# EAGLE design escon-50-5-mobo (EAGLE 7.7.0)
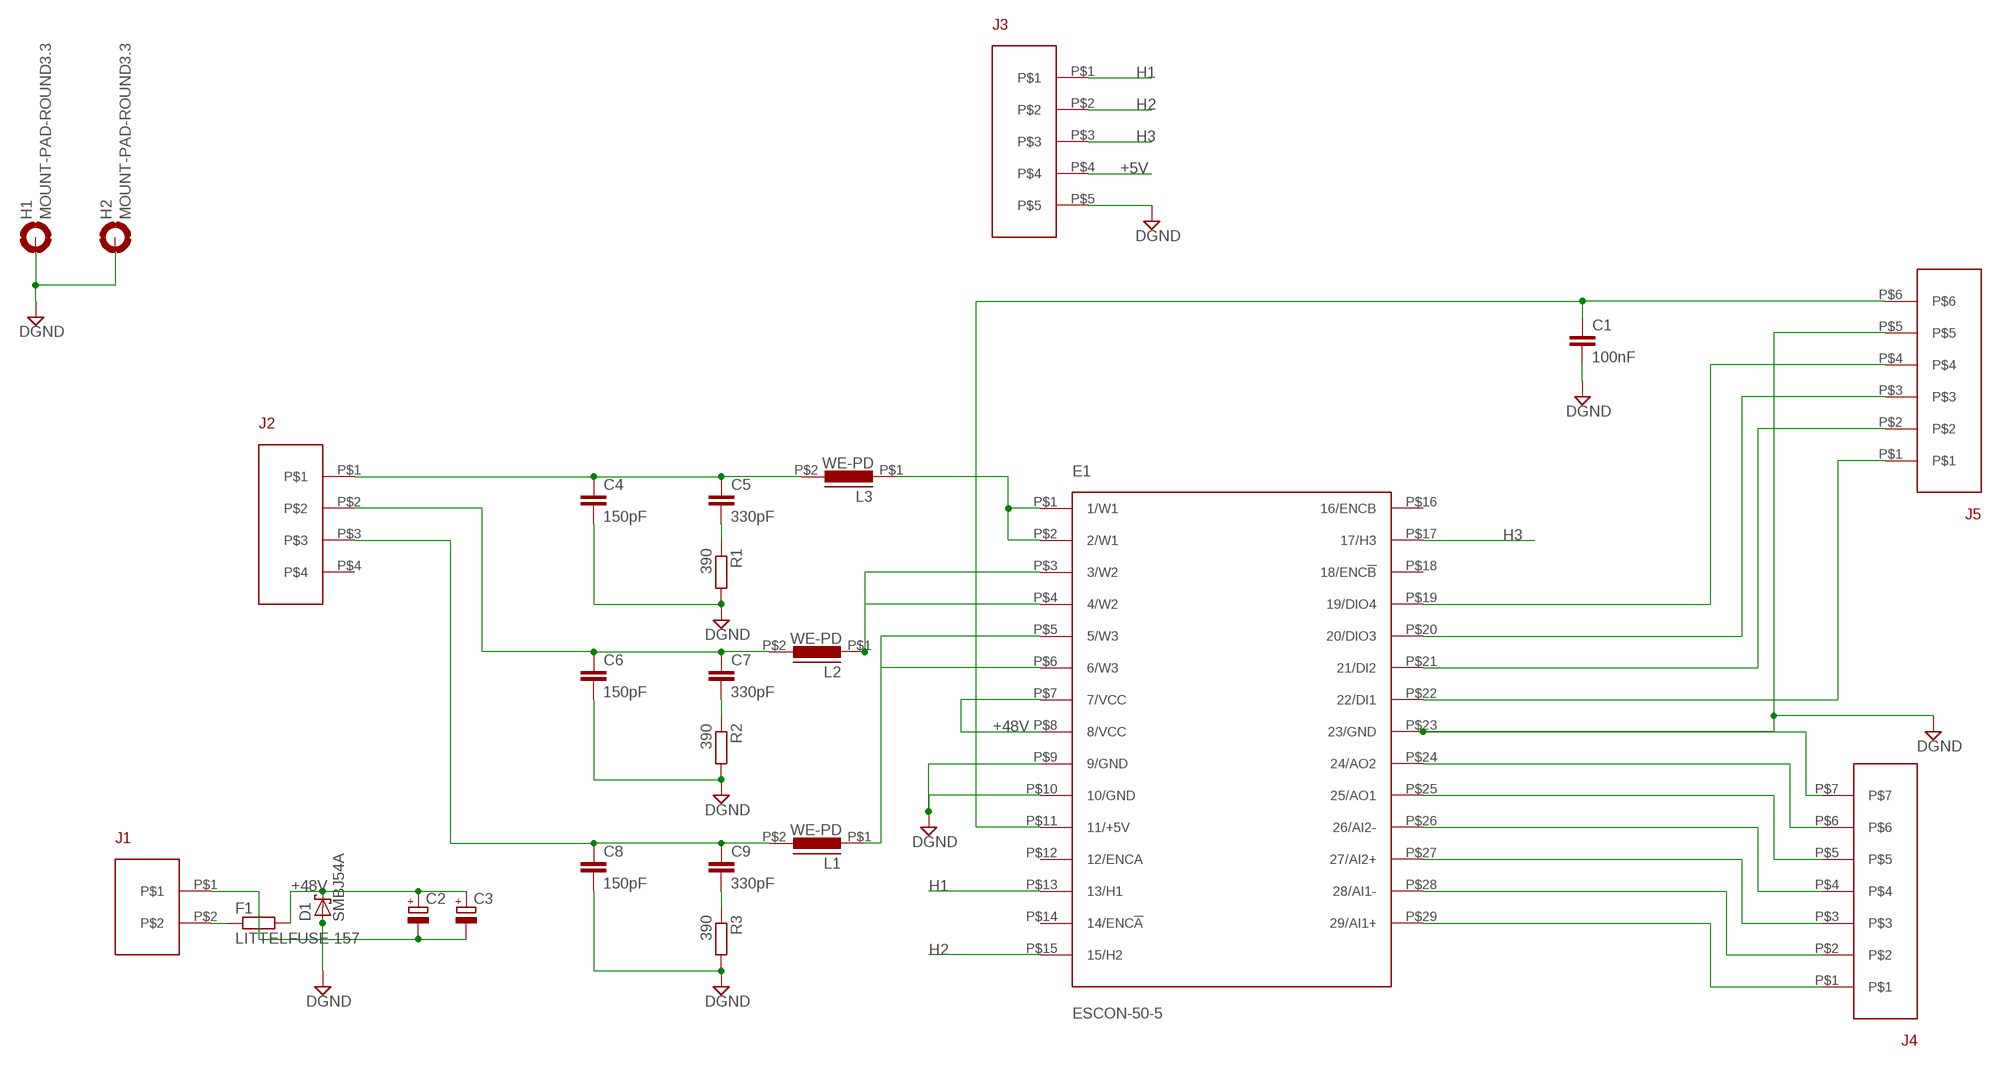
[diagram p0: schematic, sheet 1]

## Parts
C1  100nF  C-EUC0805  [C0805]
C2  CPOL-EUE5-13  [E5-13]
C3  CPOL-EUE5-13  [E5-13]
C4  150pF  C-EUC0805  [C0805]
C5  330pF  C-EUC0805  [C0805]
C6  150pF  C-EUC0805  [C0805]
C7  330pF  C-EUC0805  [C0805]
C8  150pF  C-EUC0805  [C0805]
C9  330pF  C-EUC0805  [C0805]
D1  SMBJ54A  [SMBJ54A]
E1  ESCON-50-5  [ESCON-50-5]
F1  LITTELFUSE-157  [LITTELFUSE-157]
H1  MOUNT-PAD-ROUND3.3  [3,3-PAD]
H2  MOUNT-PAD-ROUND3.3  [3,3-PAD]
J1  PHOENIX-COMBICON-MCV-2POS  [PHOENIX-COMBICON-MCV-2POS]
J2  PHOENIX-COMBICON-MCV-4POS  [PHOENIX-COMBICON-MCV-4POS]
J3  PHOENIX-COMBICON-MCV-5POS  [PHOENIX-COMBICON-MCV-5POS]
J4  PHOENIX-COMBICON-MCV-7POS  [PHOENIX-COMBICON-MCV-7POS]
J5  PHOENIX-COMBICON-MCV-6POS  [PHOENIX-COMBICON-MCV-6POS]
L1  WE-PD  [WE-PD]
L2  WE-PD  [WE-PD]
L3  WE-PD  [WE-PD]
R1  390  R-EU_R0805  [R0805]
R2  390  R-EU_R0805  [R0805]
R3  390  R-EU_R0805  [R0805]

## Nets
+5V: C1.1 E1.P$11(11/+5V) J3.P$4 J5.P$6
+48V: C2.+ C3.+ D1.P$2(C) E1.P$7(7/VCC) E1.P$8(8/VCC) F1.P$2
DGND: C1.2 C2.- C3.- C4.2 C6.2 C8.2 D1.P$1(A) E1.P$9(9/GND) E1.P$10(10/GND) E1.P$23(23/GND) H1.B3,3(MOUNT) H2.B3,3(MOUNT) J1.P$1 J3.P$5 J4.P$7 J5.P$5 R1.2 R2.2 R3.2
H1: E1.P$13(13/H1) J3.P$1
H2: E1.P$15(15/H2) J3.P$2
H3: E1.P$17(17/H3) J3.P$3
N$1: E1.P$22(22/DI1) J5.P$1
N$2: E1.P$21(21/DI2) J5.P$2
N$3: E1.P$20(20/DIO3) J5.P$3
N$4: E1.P$19(19/DIO4) J5.P$4
N$5: E1.P$1(1/W1) E1.P$2(2/W1) L3.P$1
N$6: E1.P$3(3/W2) E1.P$4(4/W2) L2.P$1
N$7: E1.P$24(24/AO2) J4.P$6
N$8: E1.P$25(25/AO1) J4.P$5
N$9: E1.P$26(26/AI2-) J4.P$4
N$10: E1.P$27(27/AI2+) J4.P$3
N$11: E1.P$28(28/AI1-) J4.P$2
N$12: E1.P$29(29/AI1+) J4.P$1
N$13: E1.P$5(5/W3) E1.P$6(6/W3) L1.P$1
N$15: C5.2 R1.1
N$16: F1.P$1 J1.P$2
N$17: C7.2 R2.1
N$19: C9.2 R3.1
W1: C4.1 C5.1 J2.P$1 L3.P$2
W2: C6.1 C7.1 J2.P$2 L2.P$2
W3: C8.1 C9.1 J2.P$3 L1.P$2
Unconnected: E1.P$12(12/ENCA) E1.P$14(14/ENC!A!) E1.P$16(16/ENCB) E1.P$18(18/ENC!B!) J2.P$4

## Library data of the parts
C1 C4-C9 = escon-50-5-mobo:C-EU: CAPACITOR, European symbol
C2 C3 = escon-50-5-mobo:CPOL-EU: POLARIZED CAPACITOR, European symbol
D1 = escon-50-5-mobo:SMBJ54A
E1 = escon-50-5-mobo:ESCON-50-5
F1 = escon-50-5-mobo:LITTELFUSE-157
H1 H2 = escon-50-5-mobo:MOUNT-PAD-ROUND: MOUNTING PAD, round
J1 = escon-50-5-mobo:PHOENIX-COMBICON-MCV-2POS
J2 = escon-50-5-mobo:PHOENIX-COMBICON-MCV-4POS
J3 = escon-50-5-mobo:PHOENIX-COMBICON-MCV-5POS
J4 = escon-50-5-mobo:PHOENIX-COMBICON-MCV-7POS
J5 = escon-50-5-mobo:PHOENIX-COMBICON-MCV-6POS
L1-L3 = escon-50-5-mobo:WE-PD
R1-R3 = escon-50-5-mobo:R-EU_: RESISTOR, European symbol

## Board
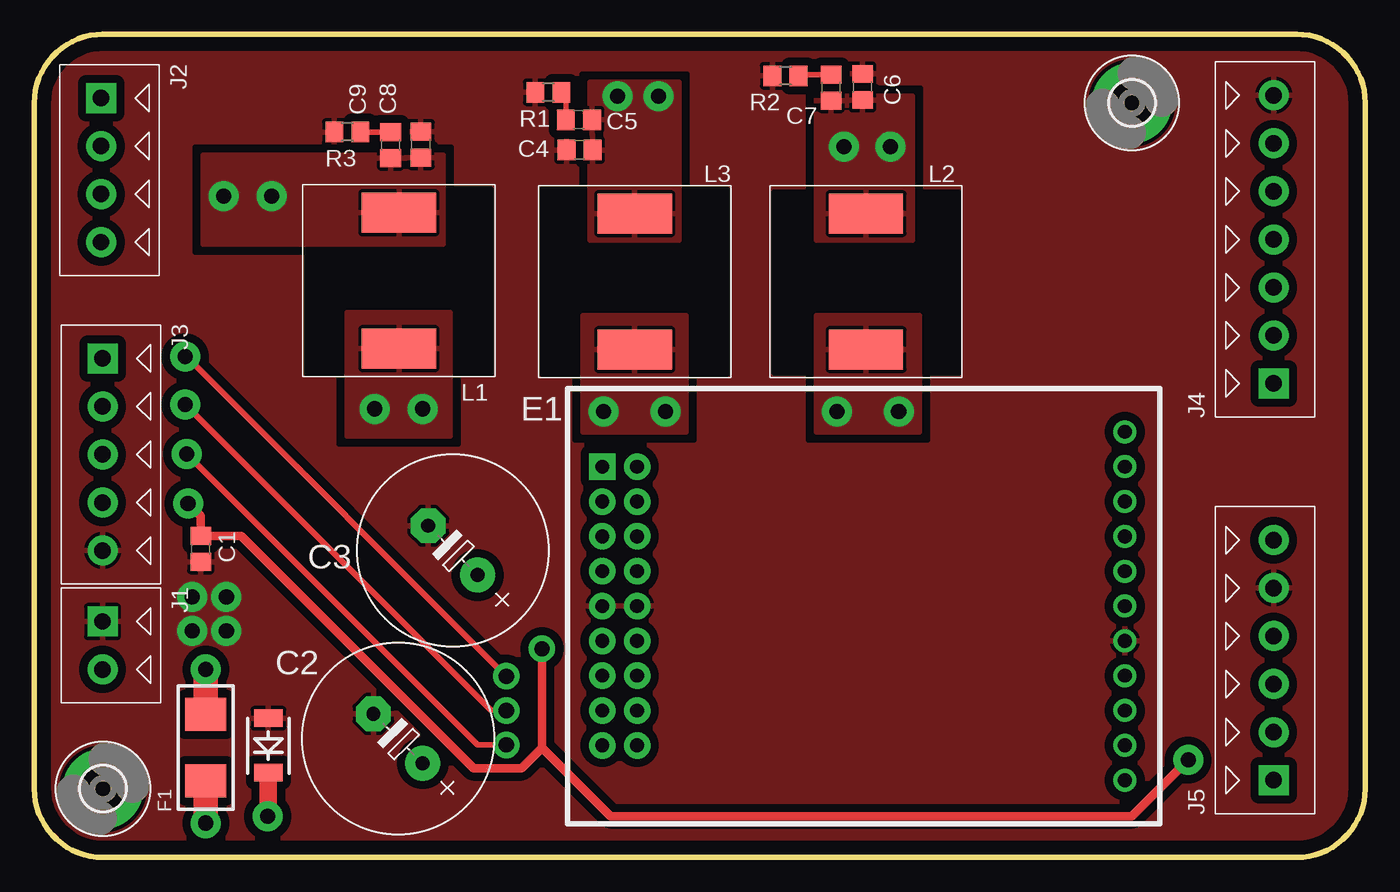
[diagram p1: board, top side]
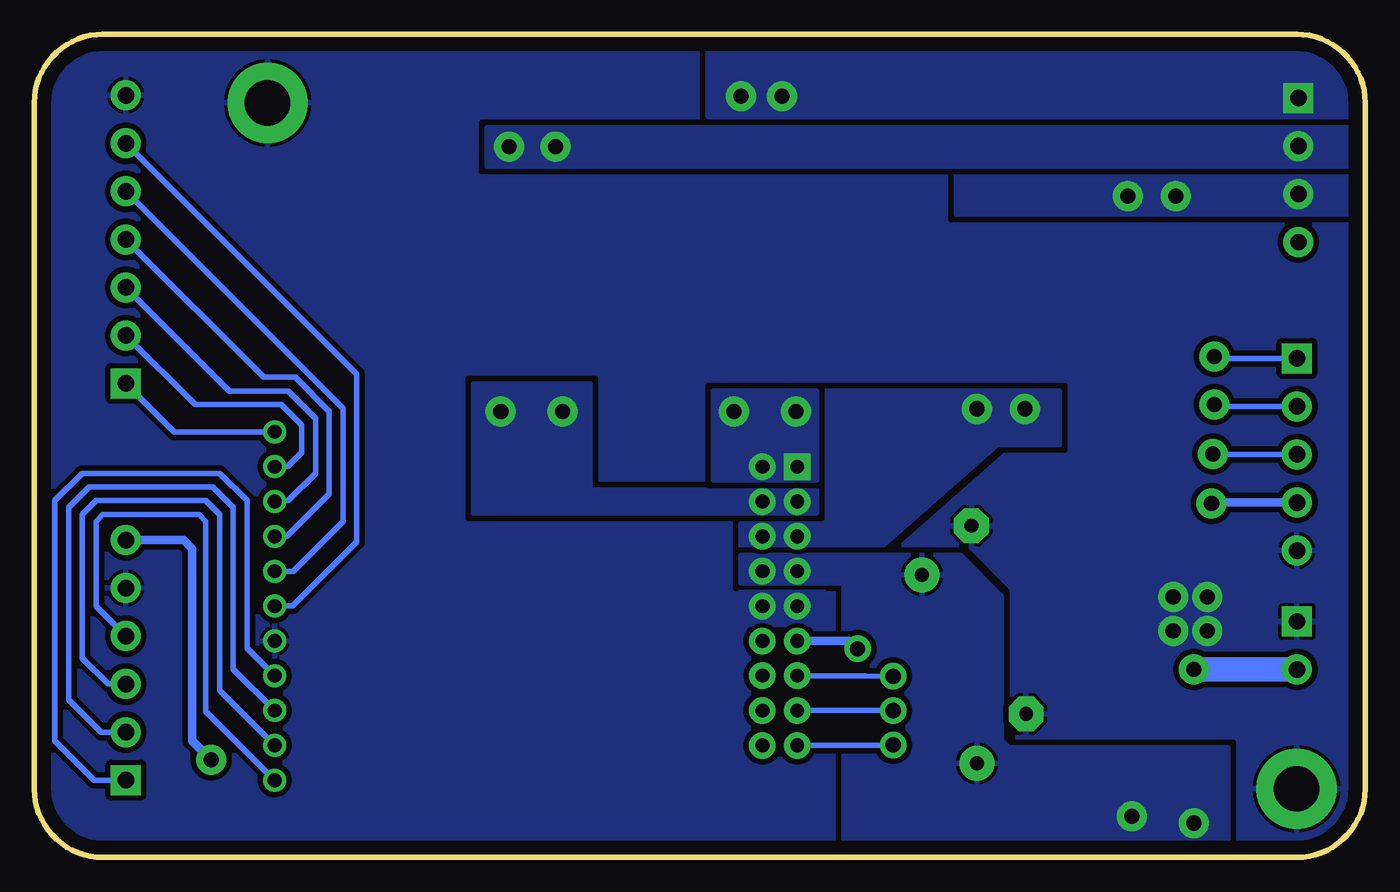
[diagram p2: board, bottom side, seen from below]

Size 97 x 60 mm. Coordinates in mm from the lower left corner, seen from the top.
Outline: 0,5 0,55 arc-90 5,60 92,60 arc-90 97,55 97,5 arc-90 92,0 5,0 arc-90 0,5
Copper layers (1*16): Top 0.035mm / dielectric 1.5mm / Bottom 0.035mm
Design rules "default": minimum track width 10mil, minimum drill 24mil, track to track 8mil, track to pad 8mil, pad to pad 8mil, via to via 8mil, smd to smd 8mil, copper to edge 40mil, drill to drill 8mil, minimum pad ring 10mil, minimum via ring 8mil, stop-mask expansion 4mil, vias tented up to drill 0mil, thermal gap 10mil

### Footprints (pad centres in the part's own frame; a part is rotated, then mirrored left to right if it is on the bottom)
C0805 = smd 1.3 x 1.5: 1 -0.95,0; 2 0.95,0
E5-13 = drill 1.016 pad 2.54: + -2.54,0 | drill 1.016 pad 2.54 octagon: - 2.54,0
SMBJ54A = smd 1.27 x 2.1: P$1 0,0; P$2 3.96,0
ESCON-50-5 = drill 1 pad 1.93 square: P$1 -19.05,10.16 | drill 1 pad 1.93: P$2 -16.51,10.16; P$3 -19.05,7.62; P$4 -16.51,7.62; P$5 -19.05,5.08; P$6 -16.51,5.08; P$7 -19.05,2.54; P$8 -16.51,2.54; P$9 -19.05,0; P$10 -16.51,0; P$11 -19.05,-2.54; P$12 -16.51,-2.54; P$13 -19.05,-5.08; P$14 -16.51,-5.08; P$15 -19.05,-7.62; P$16 -16.51,-7.62; P$17 -19.05,-10.16; P$18 -16.51,-10.16 | drill 1 pad 1.676: P$19 19.05,-12.7; P$20 19.05,-10.16; P$21 19.05,-7.62; P$22 19.05,-5.08; P$23 19.05,-2.54; P$24 19.05,0; P$25 19.05,2.54; P$26 19.05,5.08; P$27 19.05,7.62; P$28 19.05,10.16; P$29 19.05,12.7
LITTELFUSE-157 = smd 2.4 x 3: P$1 -2.43,0; P$2 2.43,0
3,3-PAD = drill 3.3 pad 5.842: B3,3 0,0
PHOENIX-COMBICON-MCV-2POS = drill 1.2 pad 2.184 square: P$1 -1.5,0 | drill 1.2 pad 2.184: P$2 2,0
PHOENIX-COMBICON-MCV-4POS = drill 1.2 pad 2.184 square: P$1 0,0 | drill 1.2 pad 2.184: P$2 3.5,0; P$3 7,0; P$4 10.5,0
PHOENIX-COMBICON-MCV-5POS = drill 1.2 pad 2.184 square: P$1 0,0 | drill 1.2 pad 2.184: P$2 3.5,0; P$3 7,0; P$4 10.5,0; P$5 14,0
PHOENIX-COMBICON-MCV-7POS = drill 1.2 pad 2.184 square: P$1 0,0 | drill 1.2 pad 2.184: P$2 3.5,0; P$3 7,0; P$4 10.5,0; P$5 14,0; P$6 17.5,0; P$7 21,0
PHOENIX-COMBICON-MCV-6POS = drill 1.2 pad 2.184 square: P$1 0,0 | drill 1.2 pad 2.184: P$2 3.5,0; P$3 7,0; P$4 10.5,0; P$5 14,0; P$6 17.5,0
WE-PD = smd 5.4 x 2.9: P$1 0,4.95; P$2 0,-4.95
R0805 = smd 1.3 x 1.5: 1 -0.95,0; 2 0.95,0

### Placement (x,y rotation side)
C1  12.13,22.49 270 top
C2  26.51,8.66 135 top
C3  30.51,22.38 135 top
C4  39.74,51.57 180 top
C5  39.69,53.77 180 top
C6  60.37,56.16 90 top
C7  58.07,56.11 90 top
C8  28.17,51.96 90 top
C9  25.97,51.92 90 top
D1  17.06,10.14 270 top
E1  60.44,18.32 0 top
F1  12.5,8 270 top
H1  80,55 0 top
H2  5,5 0 top
J1  4.97,15.7 270 top
J2  4.87,55.35 270 top
J3  4.97,36.37 270 top
J4  90.33,34.55 90 top
J5  90.33,5.63 90 top
L1  26.57,42.04 180 top
L2  60.62,41.97 180 top
L3  43.76,41.97 180 top
R1  37.46,55.77 180 top
R2  54.74,56.97 180 top
R3  22.82,52.87 180 top

### Tracks (layer width: path | path; a pad name or v marks a point on that pad's centre or on a via)
+5V  (via drill 1.1 pad 1.93, 1.1 pad 2.18)
  Top 0.61: v11.2,25.8 12.13,24.87 C1.1 15.06,23.44 32,6.5 35.5,6.5 37,8 | 37,8 v37,15.2 | 37,8 42,3 80,3 v84.1,7.1
  Bottom 0.61: J3.P$4 11.2,25.87 v11.2,25.8 | v37,15.2 37.58,15.78 E1.P$11 | v84.1,7.1 85.5,8.5 85.5,22.5 86.13,23.13 J5.P$6
+48V  (via drill 1.1 pad 2.18)
  Top 1.27: D1.P$2 17.06,3.06 v17,3
  Top 1.778: F1.P$2 v12.5,2.5
  pour Bottom (isolate 0.406, rank 2): 10,8 10,1 38,1 38,20 45.5,20 45.5,22 29.5,22 26.5,19 26.5,8.5 26,8
  pour Bottom (isolate 0.305, no thermals): 39.5,22 45.5,22 45.5,20 39.5,20
DGND  (via drill 1.1 pad 2.18)
  other vias: 14,16.5 11.5,16.5 11.5,19 14,19
  pour Bottom (isolate 0.406, rank 5): -0.5,60.5 100.5,60.5 100.5,-0.5 -0.5,-0.5
  pour Top (isolate 0.61, rank 2): -0.5,60.5 100.5,60.5 100.5,-0.5 -0.5,-0.5
  pour Bottom (isolate 0.305, rank 5, no thermals): 39.5,19.5 45.5,19.5 45.5,17 39.5,17
  pour Top (rank 2): 76,53.5 76,34.5 67.5,34.5 67.5,53.5
H1  (via drill 1.1 pad 1.93, 1.1 pad 2.18)
  Top 0.406: v34.4,13.2 11.1,36.5 v11,36.5
  Bottom 0.406: J3.P$1 11,36.37 v11,36.5 | v34.4,13.2 36.44,13.24 E1.P$13
H2  (via drill 1.1 pad 1.93, 1.1 pad 2.18)
  Top 0.406: v11,33 33.3,10.7 v34.4,10.7
  Bottom 0.406: J3.P$2 11,32.87 v11,33 | v34.4,10.7 E1.P$15
H3  (via drill 1.1 pad 1.93, 1.1 pad 2.18)
  Top 0.406: v11.1,29.4 32.3,8.2 v34.4,8.2
  Bottom 0.406: J3.P$3 11.07,29.37 v11.1,29.4 | v34.4,8.2 34.44,8.16 E1.P$17
N$1
  Bottom 0.406: E1.P$22 81.5,15.25 81.5,26 83.5,28 93.5,28 95.5,26 95.5,8.5 92.63,5.63 J5.P$1
N$2
  Bottom 0.406: E1.P$21 82.5,13.71 82.5,25.5 84,27 93,27 94.5,25.5 94.5,11.5 92.13,9.13 J5.P$2
N$3
  Bottom 0.406: E1.P$20 83.5,12.17 83.5,25 84.5,26 92.5,26 93.5,25 93.5,14.5 91.63,12.63 J5.P$3
N$4
  Bottom 0.406: E1.P$19 84.5,10.63 84.5,24.5 85,25 92,25 92.5,24.5 92.5,18.3 J5.P$4
N$5  (via drill 1.1 pad 2.18)
  other vias: 46,32.5 41.5,32.5
  pour Top (isolate 0.61): 40,39.5 40,31 47.5,31 47.5,39.5
  pour Bottom (isolate 0.406, no thermals): 40,34 47.5,34 47.5,27.5 40,27.5
N$6  (via drill 1.1 pad 2.18)
  other vias: 58.5,32.5 63,32.5
  pour Top (isolate 0.61): 57,39.5 57,31 64.5,31 64.5,39.5
  pour Bottom (isolate 0.406, rank 2, no thermals): 40,26.8 56.5,26.8 56.5,34.5 65,34.5 65,25.1 40,25.1
N$7
  Bottom 0.406: J4.P$6 73.5,35.22 73.5,23 78.18,18.32 E1.P$24
N$8
  Bottom 0.406: J4.P$5 74.5,32.72 74.5,24.5 78.14,20.86 E1.P$25
N$9
  Bottom 0.406: J4.P$4 80.28,35 78,35 75.5,32.5 75.5,26.5 78.6,23.4 E1.P$26
N$10
  Bottom 0.406: J4.P$3 82.78,34 78.5,34 76.5,32 76.5,28 78.49,26.01 E1.P$27
N$11
  Bottom 0.406: E1.P$28 78.52,28.48 77.5,29.5 77.5,31.5 79,33 85.28,33 J4.P$2
N$12
  Bottom 0.406: E1.P$29 86.8,31.02 J4.P$1
N$13  (via drill 1.1 pad 2.18)
  other vias: 24.8,32.7 28.3,32.7
  pour Top (isolate 0.61): 22.8,39.7 22.8,30.7 30.3,30.7 30.3,39.7
  pour Bottom (isolate 0.406, rank 3, no thermals): 45.5,24.3 39.5,24.3 39.5,34 22.3,34 22.3,30.1 26.8,30.1 36,22 45.5,22
N$14
  cutout Top (isolate 0.305): 19.9,44.2 30.8,44.2 30.8,48.7 33.3,48.7 33.3,35.2 31.3,35.2 31.3,40.2 21.8,40.2 21.8,35.2 19.9,35.2
  cutout Top (isolate 0.305): 37,48.7 39.5,48.7 39.5,43.7 48,43.7 48,48.7 50.5,48.7 50.5,35.2 48.5,35.2 48.5,40.7 39,40.7 39,35.2 37,35.2
  cutout Top (isolate 0.305): 53.9,48.5 56.4,48.5 56.4,43.5 64.9,43.5 64.9,48.5 67.4,48.5 67.4,35.3 65.4,35.3 65.4,40.5 55.9,40.5 55.9,35.3 53.9,35.3
N$15
  Top 0.406: R1.1 38.74,55.44 C5.2
N$16  (via drill 1.1 pad 2.18)
  Top 1.778: v12.5,13.7 F1.P$1
  Bottom 1.778: J1.P$2 v12.5,13.7
N$17
  Top 0.406: R2.1 55.78,57.06 C7.2
N$19
  Top 0.406: R3.1 C9.2
W1  (via drill 1.1 pad 2.18)
  other vias: 45.5,55.5 42.5,55.5
  pour Bottom (isolate 0.406, no thermals): 0.5,60 47.9,60 47.9,54 0.5,54
  pour Top (isolate 0.61): 40.5,45 40.5,56.5 47,56.5 47,45
W2  (via drill 1.1 pad 2.18)
  other vias: 62.4,51.8 59,51.8
  pour Bottom (isolate 0.406, rank 2, no thermals): 0,53.2 64,53.2 64,50.4 0,50.4
  pour Top (isolate 0.61): 57,55.5 64,55.5 64,45 57,45
W3  (via drill 1.1 pad 2.18)
  other vias: 13.8,48.2 17.3,48.2
  pour Top (isolate 0.61): 12.3,51.2 29.8,51.2 29.8,44.7 12.3,44.7
  pour Bottom (isolate 0.406, rank 3, no thermals): 0,50 29.8,50.2 29.8,46.9 0.1,46.9

### Text on the board
tRestrict: ESCON 50-5 / MOBO 1.0